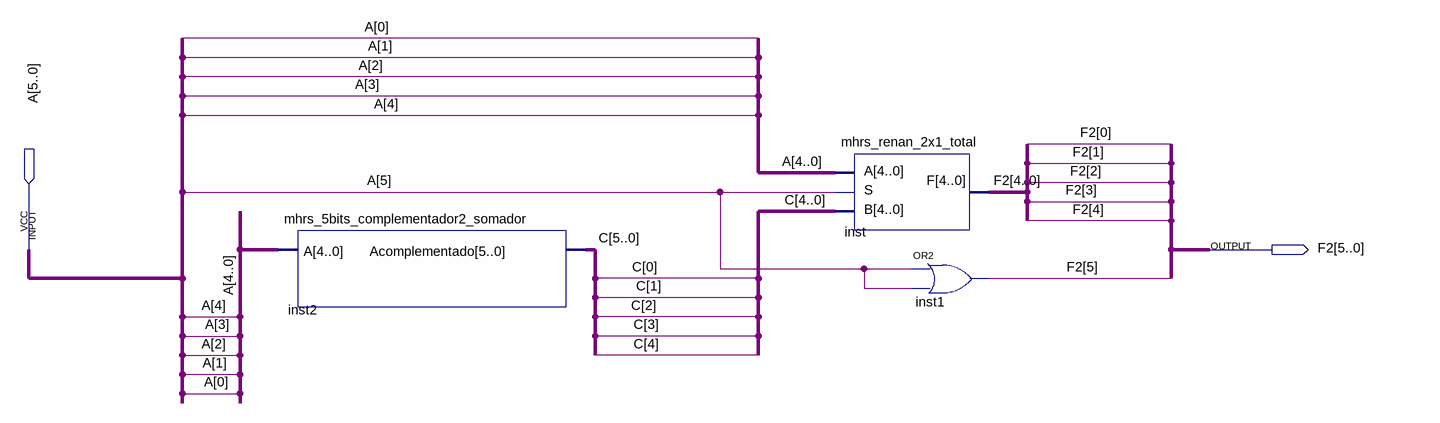
[diagram p0: schematic sheet]
// Quartus schematic mhrs_5bits_seletor_cmp2.bdf as structural Verilog: 3 symbols, 2 pins
module mhrs_5bits_seletor_cmp2 (
  input  [5:0] A,
  output [5:0] F2
);

  wire [5:0] C;

  mhrs_5bits_complementador2_somador inst2 (.A(A[4:0]), .Acomplementado(C));
  mhrs_renan_2x1_total inst (.S(A[5]), .A(A[4:0]), .B(C[4:0]), .F(F2[4:0]));
  or inst1 (F2[5], A[5], A[5]);
endmodule
